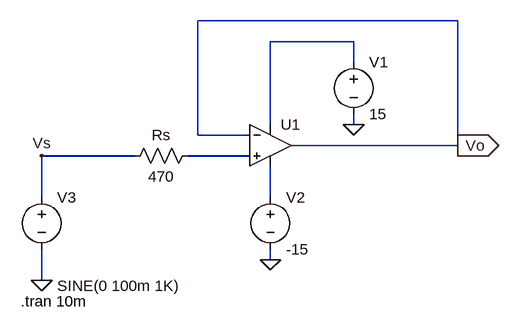
[diagram p0: schematic Run_3_A.asc]
Run_3_A.asc, the LTspice schematic file:
Version 4
SHEET 1 880 680
WIRE 608 -16 208 -16
WIRE 448 16 320 16
WIRE 448 48 448 16
WIRE 320 144 320 16
WIRE 448 144 448 128
WIRE 208 160 208 -16
WIRE 288 160 208 160
WIRE 608 176 608 -16
WIRE 608 176 352 176
WIRE 112 192 -32 192
WIRE 288 192 192 192
WIRE -32 256 -32 192
WIRE 320 256 320 208
WIRE 320 352 320 336
WIRE -32 384 -32 336
FLAG -32 384 0
FLAG 608 176 Vo
IOPIN 608 176 Out
FLAG -32 192 Vs
FLAG 448 144 0
FLAG 320 352 0
SYMBOL OpAmps\\UniversalOpamp2 320 176 R0
SYMATTR InstName U1
SYMBOL res 208 176 R90
WINDOW 0 0 56 VBottom 2
WINDOW 3 32 56 VTop 2
SYMATTR InstName Rs
SYMATTR Value 470
SYMBOL voltage -32 240 R0
WINDOW 3 24 152 Left 2
WINDOW 123 24 124 Left 2
WINDOW 39 0 0 Left 0
SYMATTR Value SINE(0 100m 1K)
SYMATTR InstName V3
SYMBOL voltage 448 32 R0
WINDOW 123 0 0 Left 0
WINDOW 39 0 0 Left 0
SYMATTR InstName V1
SYMATTR Value 15
SYMBOL voltage 320 240 R0
WINDOW 123 0 0 Left 0
WINDOW 39 0 0 Left 0
SYMATTR InstName V2
SYMATTR Value -15
TEXT -64 416 Left 2 !.tran 10m

The netlist it stands for:
* Run_3_A.asc
XU1 N002 Vo N001 N003 Vo level.2 Avol=1Meg GBW=10Meg Slew=10Meg ilimit=25m rail=0 Vos=0 phimargin=45 en=0 enk=0 in=0 ink=0 Rin=500Meg  ; pins IN+ IN- V+ V- OUT
Rs N002 Vs 470
V3 Vs 0 SINE(0 100m 1K)
V1 N001 0 15
V2 N003 0 -15
.tran 10m
.lib UniversalOpamps2.sub
.backanno
.end